# Altium schematic sheet Sheet1.SchDoc
size A4
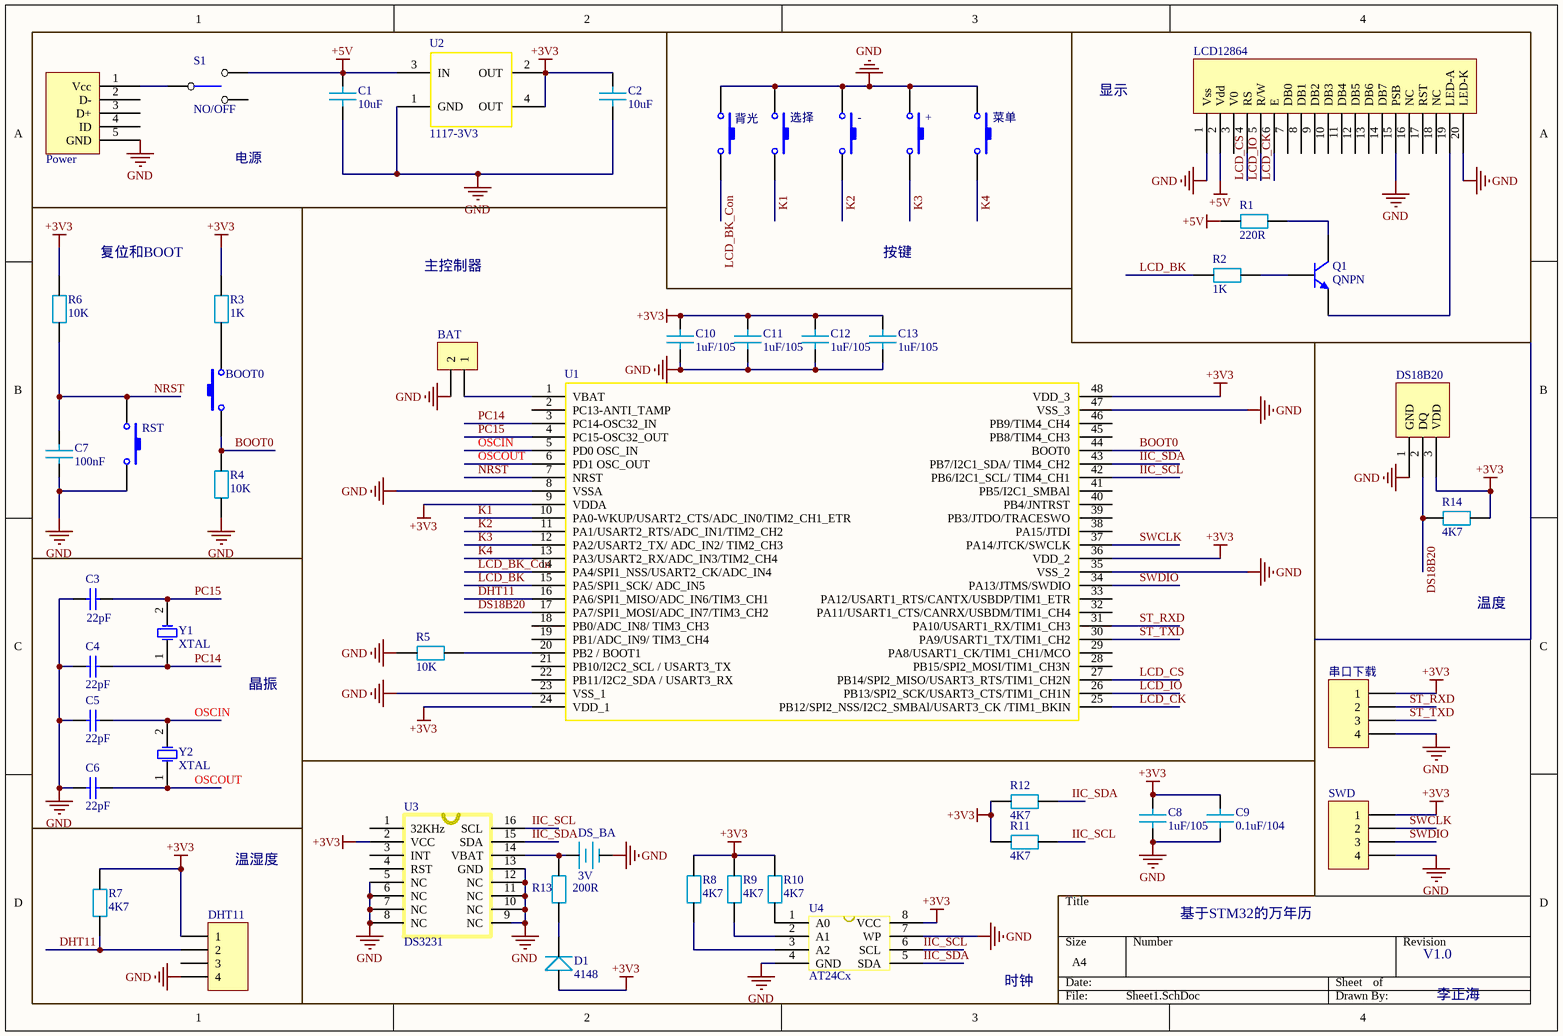
[diagram p0: Sheet1.SchDoc]

## Parts
+  SW-PB  [贴片按键]  (value not drawn)
-  SW-PB  [贴片按键]  (value not drawn)
BAT  HDR1x2  [PIN-2-2.54-1.0]  (value not drawn)
BOOT0  SW-PB  [贴片按键]  (value not drawn)
C1  10uF  [0805C]
C2  10uF  [0805C]
C3  22pF  [0805C]
C4  22pF  [0805C]
C5  22pF  [0805C]
C6  22pF  [0805C]
C7  100nF  [0805C]
C8  1uF/105  [0805C]
C9  0.1uF/104  [0805C]
C10  1uF/105  [0805C]
C11  1uF/105  [0805C]
C12  1uF/105  [0805C]
C13  1uF/105  [0805C]
D1  4148  [0805D]
DHT11  Header 4  [DHT11]  (value not drawn)
DS18B20  DS18B20  [TO-92]  (value not drawn)
DS_BA  3V  [BAT-3V]
LCD12864  LCD12864  [HDR1X20]  (value not drawn)
Power  USB  [USB_MNI_B]  (value not drawn)
Q1  QNPN  [SOT-23B_N]
R1  220R  [0805R]
R2  1K  [0805R]
R3  1K  [0805R]
R4  10K  [0805R]
R5  10K  [0805R]
R6  10K  [0805R]
R7  4K7  [0805R]
R8  4K7  [0805R]
R9  4K7  [0805R]
R10  4K7  [0805R]
R11  4K7  [0805R]
R12  4K7  [0805R]
R13  200R  [0805R]
R14  4K7  [0805R]
RST  SW-PB  [贴片按键]  (value not drawn)
S1  NO/OFF  [SS12D01]
SWD  Header 4  [HDR1X4]  (value not drawn)
U1  STM32F103C8T6  [QFP-48-0.5]  (value not drawn)
U2  1117-3V3  [AMS1117]
U3  DS3231  [DS3231]
U4  AT24Cx  [SOP8]
Y1  XTAL  [XTAL6X2]
Y2  XTAL  [XTAL_49S_P]
串口下载  Header 4  [HDR1X4]  (value not drawn)
背光  SW-PB  [贴片按键]  (value not drawn)
菜单  SW-PB  [贴片按键]  (value not drawn)
选择  SW-PB  [贴片按键]  (value not drawn)

## Nets
+3V3: C2.2 C8.2 C9.2 C10.2 C11.2 C12.2 C13.2 D1.1 DHT11.1 DS18B20.3(VDD) R3.2 R6.2 R7.2 R8.2 R9.2 R10.2 R11.2 R12.2 R14.1 SWD.1 U1.9(VDDA) U1.24(VDD_1) U1.36(VDD_2) U1.48(VDD_3) U2.2(OUT) U2.4(OUT) U3.2(VCC) U4.8(VCC) 串口下载.1
+5V: C1.2 LCD12864.2(Vdd) R1.2 S1.1 U2.3(IN)
GND: +.1 -.1 BAT.2 C1.1 C2.1 C3.1 C4.1 C5.1 C6.1 C7.1 C8.1 C9.1 C10.1 C11.1 C12.1 C13.1 DHT11.4 DS18B20.1(GND) DS_BA.2 LCD12864.1(Vss) LCD12864.15(PSB) LCD12864.20(LED-K) Power.5(GND) R4.1 R5.2 RST.1 SWD.4 U1.8(VSSA) U1.23(VSS_1) U1.35(VSS_2) U1.47(VSS_3) U2.1(GND) U3.5(NC) U3.6(NC) U3.7(NC) U3.8(NC) U3.9(NC) U3.10(NC) U3.11(NC) U3.12(NC) U3.13(GND) U4.4(GND) U4.7(WP) 串口下载.4 背光.1 菜单.1 选择.1
BOOT0: BOOT0.1 R4.2 U1.44(BOOT0)
DHT11: DHT11.2 R7.1 U1.16(PA6/SPI1_MISO/ADC_IN6/TIM3_CH1)
DS18B20: DS18B20.2(DQ) R14.2 U1.17(PA7/SPI1_MOSI/ADC_IN7/TIM3_CH2)
IIC_SCL: R11.1 U1.42(PB6/I2C1_SCL/_TIM4_CH1) U3.16(SCL) U4.6(SCL)
IIC_SDA: R12.1 U1.43(PB7/I2C1_SDA/_TIM4_CH2) U3.15(SDA) U4.5(SDA)
K1: U1.10(PA0-WKUP/USART2_CTS/ADC_IN0/TIM2_CH1_ETR) 选择.2
K2: -.2 U1.11(PA1/USART2_RTS/ADC_IN1/TIM2_CH2)
K3: +.2 U1.12(PA2/USART2_TX/_ADC_IN2/_TIM2_CH3)
K4: U1.13(PA3/USART2_RX/ADC_IN3/TIM2_CH4) 菜单.2
LCD_BK: R2.1 U1.15(PA5/SPI1_SCK/_ADC_IN5)
LCD_BK_Con: U1.14(PA4/SPI1_NSS/USART2_CK/ADC_IN4) 背光.2
LCD_CK: LCD12864.6(E) U1.25(PB12/SPI2_NSS/I2C2_SMBAl/USART3_CK_/TIM1_BKIN)
LCD_CS: LCD12864.4(RS) U1.27(PB14/SPI2_MISO/USART3_RTS/TIM1_CH2N)
LCD_IO: LCD12864.5(R/W) U1.26(PB13/SPI2_SCK/USART3_CTS/TIM1_CH1N)
NRST: C7.2 R6.1 RST.2 U1.7(NRST)
OSCIN: C5.2 U1.5(PD0_OSC_IN) Y2.2(OSC2)
OSCOUT: C6.2 U1.6(PD1_OSC_OUT) Y2.1(OSC1)
PC14: C4.2 U1.3(PC14-OSC32_IN) Y1.1(OSC1)
PC15: C3.2 U1.4(PC15-OSC32_OUT) Y1.2(OSC2)
ST_RXD: U1.31(PA10/USART1_RX/TIM1_CH3) 串口下载.2
ST_TXD: U1.30(PA9/USART1_TX/TIM1_CH2) 串口下载.3
SWCLK: SWD.2 U1.37(PA14/JTCK/SWCLK)
SWDIO: SWD.3 U1.34(PA13/JTMS/SWDIO)
NetBAT_1: BAT.1 U1.1(VBAT)
NetBOOT0_2: BOOT0.2 R3.1
NetD1_2: D1.2 R13.1
NetDS_BA_1: DS_BA.1 R13.2 U3.14(VBAT)
NetLCD12864_19: LCD12864.19(LED-A) Q1.3(E)
NetPower_1: Power.1(Vcc) S1.2
NetQ1_1: Q1.1(C) R1.1
NetQ1_2: Q1.2(B) R2.2
NetR5_1: R5.1 U1.20(PB2_/_BOOT1)
NetR8_1: R8.1 U4.3(A2)
NetR9_1: R9.1 U4.2(A1)
NetR10_1: R10.1 U4.1(A0)

Not connected (* = marked no-connect by the designer): DHT11 3; LCD12864 3(V0) 7(DB0) 8(DB1) 9(DB2) 10(DB3) 11(DB4) 12(DB5) 13(DB6) 14(DB7) 16(NC) 17(RST) 18(NC); Power 2(D-) 3(D+) 4(ID); S1 3; U1 2(PC13-ANTI_TAMP) 18(PB0/ADC_IN8/_TIM3_CH3) 19(PB1/ADC_IN9/_TIM3_CH4) 21(PB10/I2C2_SCL_/_USART3_TX) 22(PB11/I2C2_SDA_/_USART3_RX) 28(PB15/SPI2_MOSI/TIM1_CH3N) 29(PA8/USART1_CK/TIM1_CH1/MCO) 32(PA11/USART1_CTS/CANRX/USBDM/TIM1_CH4) 33(PA12/USART1_RTS/CANTX/USBDP/TIM1_ETR) 38(PA15/JTDI) 39(PB3/JTDO/TRACESWO) 40(PB4/JNTRST) 41(PB5/I2C1_SMBAl) 45(PB8/TIM4_CH3) 46(PB9/TIM4_CH4); U3 1(32KHz) 3(INT) 4(RST)

## Notes on the sheet
- 显示
- 电源
- 复位和BOOT
- 主控制器
- 按键
- 温度
- 晶振
- 温湿度
- 基于STM32的万年历
- 时钟
- V1.0
- 李正海

## Library data of the parts
+ - BOOT0 RST 背光 菜单 选择 = SW-PB: Switch; Published: 24-Mar-1999; LatestRevisionDate: 17-Jul-2002; LatestRevisionNote: Re-released for DXP Platform.; PackageReference: SPST-2; Publisher: Altium Limited; PackageDescription: Switch; 2 Leads
BAT = HDR1x2: Connector
C1 C2 C7-C13 = C
C3-C6 = Cap: Capacitor; Published: 8-Jun-2000; LatestRevisionDate: 17-Jul-2002; LatestRevisionNote: Re-released for DXP Platform.; PackageReference: RAD-0.3; Publisher: Altium Limited; PackageDescription: Radial Cap, Thru-Hole; 2 Leads; 0.3 in Pin Spacing; Value: 22pF
D1 = DIODE: 二极管
DHT11 SWD 串口下载 = Header 4: Header, 4-Pin; LatestRevisionDate: 17-Jul-2002; LatestRevisionNote: Re-released for DXP Platform.; Publisher: Altium Limited
DS_BA = BATTERY: 电池
Q1 = QNPN: NPN Bipolar Transistor; Published: 8-Jun-2000; LatestRevisionDate: 29-May-2009; LatestRevisionNote: IPC-7351 Footprint Added.; PackageVersion: Aug-1999; PackageReference: SOT-23B; Publisher: Altium Limited; PackageDescription: 3-Pin SOT-23 Package 0.95 mm Pitch, 2.4 mm Lead Span
R1-R14 = R
S1 = SW-SPDT: 单刀双掷
Y1 Y2 = XTAL: Crystal Oscillator; Published: 8-Jun-2000; LatestRevisionDate: 17-Jul-2002; LatestRevisionNote: Re-released for DXP Platform.; PackageReference: R38; Publisher: Altium Limited; PackageDescription: Crystal, Thru-Hole; 2 Leads; Body 3.1 x 8.2 mm (Dia.xH)